# Altium schematic sheet uSD.SchDoc
size 386 x 246 mm
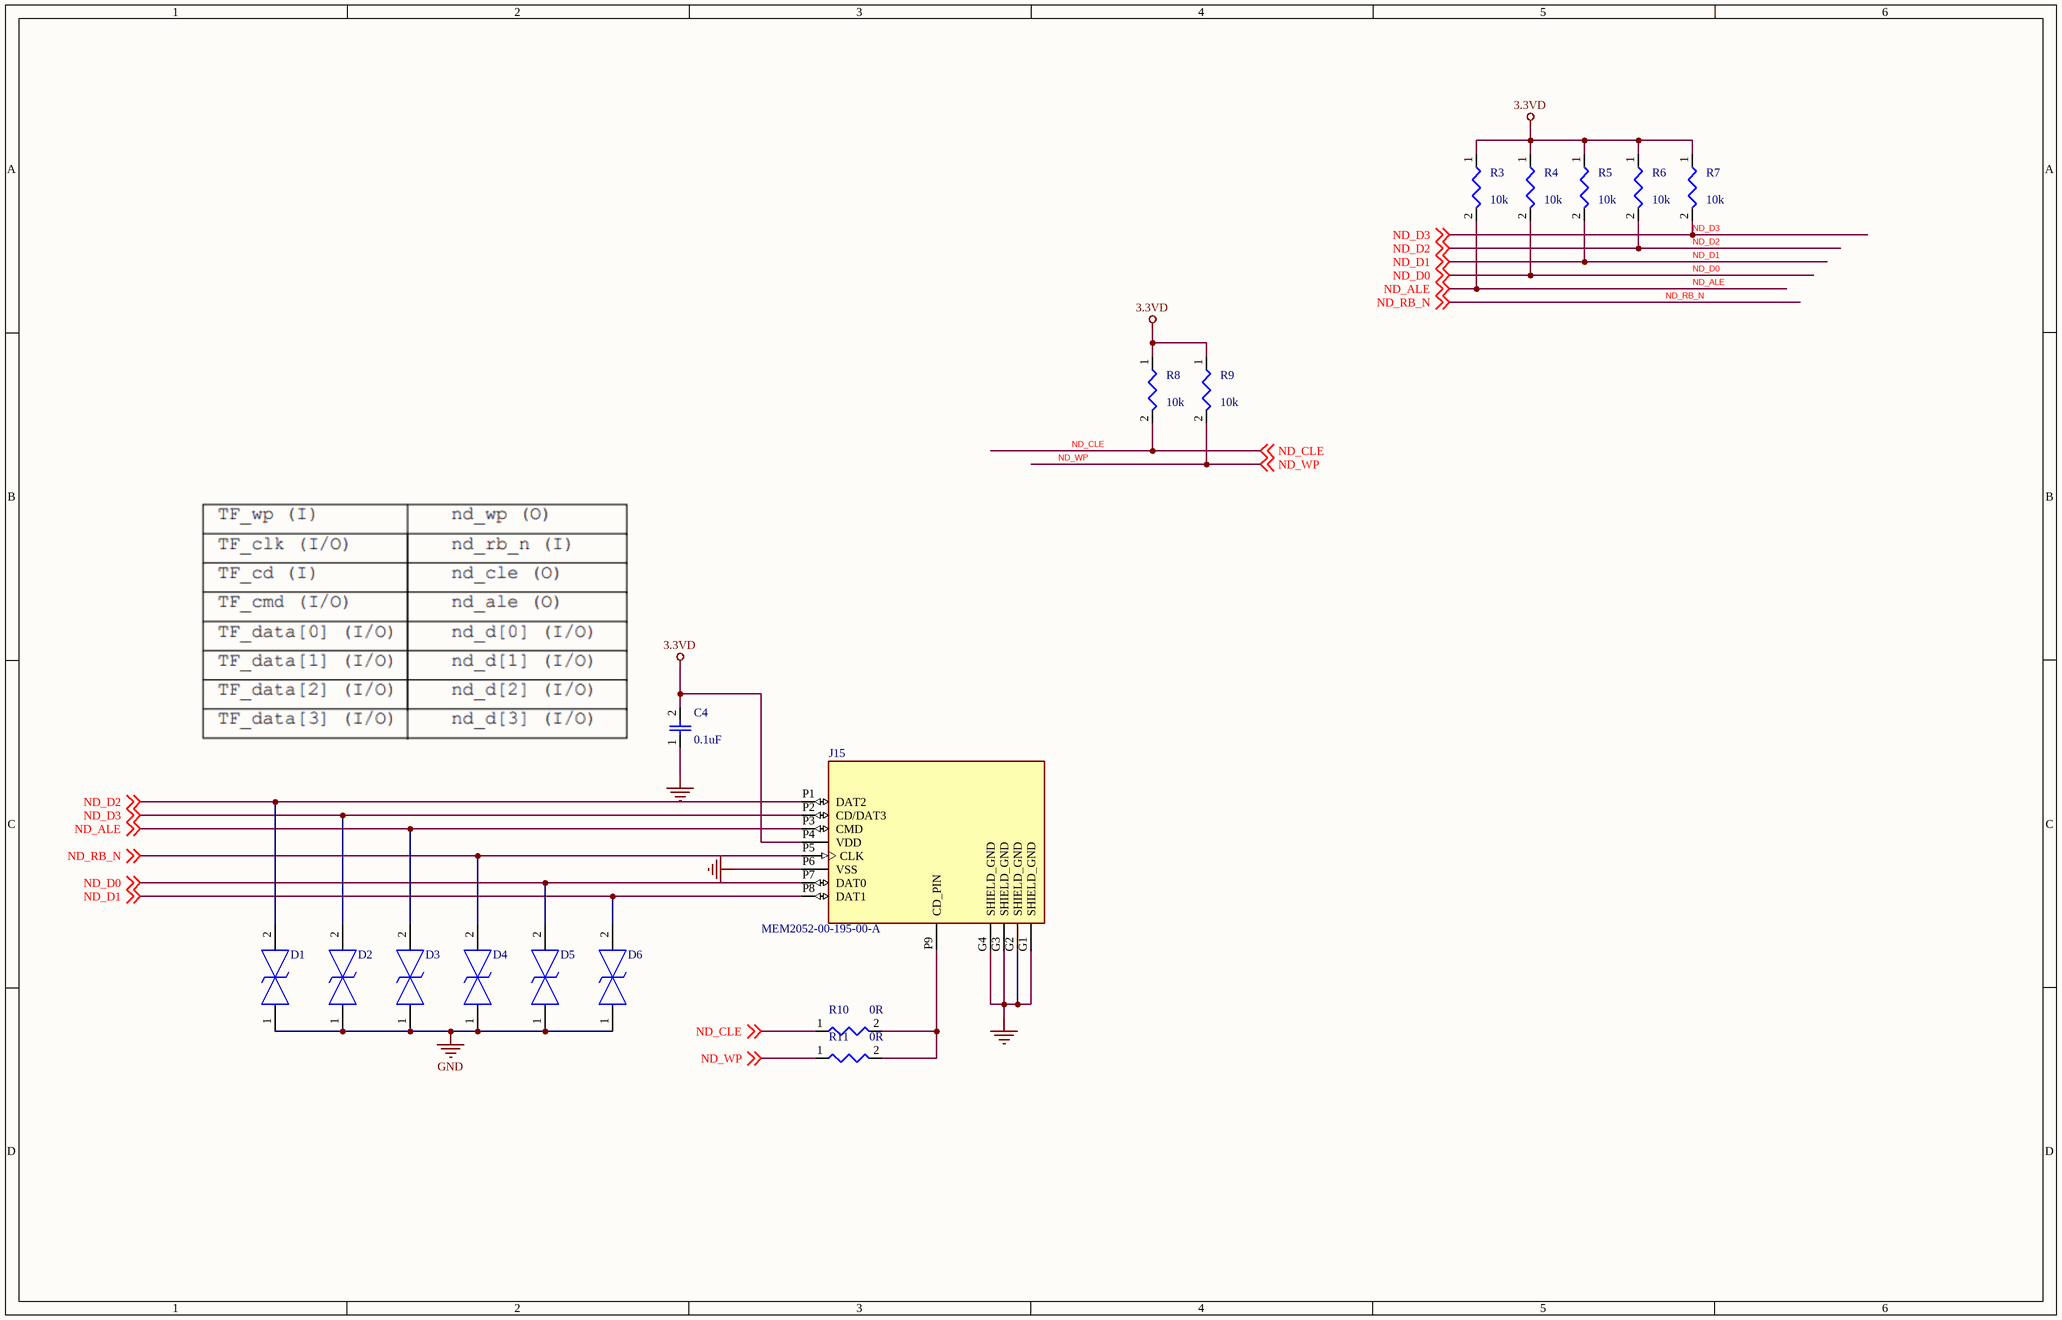
[diagram p0: uSD.SchDoc]

## Parts
C4  0.1uF  [0402-C]
D1  ESD9B5VL-2_TR  [ESD9B5VL2TR]  (value not drawn)
D2  ESD9B5VL-2_TR  [ESD9B5VL2TR]  (value not drawn)
D3  ESD9B5VL-2_TR  [ESD9B5VL2TR]  (value not drawn)
D4  ESD9B5VL-2_TR  [ESD9B5VL2TR]  (value not drawn)
D5  ESD9B5VL-2_TR  [ESD9B5VL2TR]  (value not drawn)
D6  ESD9B5VL-2_TR  [ESD9B5VL2TR]  (value not drawn)
J15  MEM2052-00-195-00-A  [GCT_MEM2052-00-195-00-A_REVA]
R3  10k  [0402-R]
R4  10k  [0402-R]
R5  10k  [0402-R]
R6  10k  [0402-R]
R7  10k  [0402-R]
R8  10k  [0402-R]
R9  10k  [0402-R]
R10  0R  [0402-R]
R11  0R  [0402-R]

## Nets
3.3VD: C4.2 J15.P4(VDD) R3.1 R4.1 R5.1 R6.1 R7.1 R8.1 R9.1
GND: C4.1 D1.1 D2.1 D3.1 D4.1 D5.1 D6.1 J15.G1(SHIELD_GND) J15.G2(SHIELD_GND) J15.G3(SHIELD_GND) J15.G4(SHIELD_GND) J15.P6(VSS)
ND_ALE: D3.2 J15.P3(CMD) R3.2 ; off-sheet ND_ALE
ND_CLE: R8.2 R10.1 ; off-sheet ND_CLE
ND_D0: D5.2 J15.P7(DAT0) R4.2 ; off-sheet ND_D0
ND_D1: D6.2 J15.P8(DAT1) R5.2 ; off-sheet ND_D1
ND_D2: D1.2 J15.P1(DAT2) R6.2 ; off-sheet ND_D2
ND_D3: D2.2 J15.P2(CD/DAT3) R7.2 ; off-sheet ND_D3
ND_RB_N: D4.2 J15.P5(CLK) ; off-sheet ND_RB_N
ND_WP: R9.2 R11.1 ; off-sheet ND_WP
NetJ15_P9: J15.P9(CD_PIN) R10.2 R11.2

## Library data of the parts
C4 = CAP
D1-D6 = ESD9B5VL-2_TR: TVS Diode (Bi-directional); Manufacturer_Name: Will Semiconductor; Manufacturer_Part_Number: ESD9B5VL-2/TR; Height: 0.55mm
J15 = MEM2052-00-195-00-A_REVA: MicroSD Push push Memory Card Connector; MF: Global Connector Technology; Package: None; Availability: Not in stock; SnapEDA_Link: https://www.snapeda.com/parts/MEM2052-00-195-00-A/Global+Connector+Technology/view-part/?ref=snap; MP: MEM2052-00-195-00-A; Price: None; Value: *; Check_prices: https://www.snapeda.com/parts/MEM2052-00-195-00-A/Global+Connector+Technology/view-part/?ref=eda
R3-R11 = Res